# Altium schematic sheet Battery_Monitor.schdoc
size A4
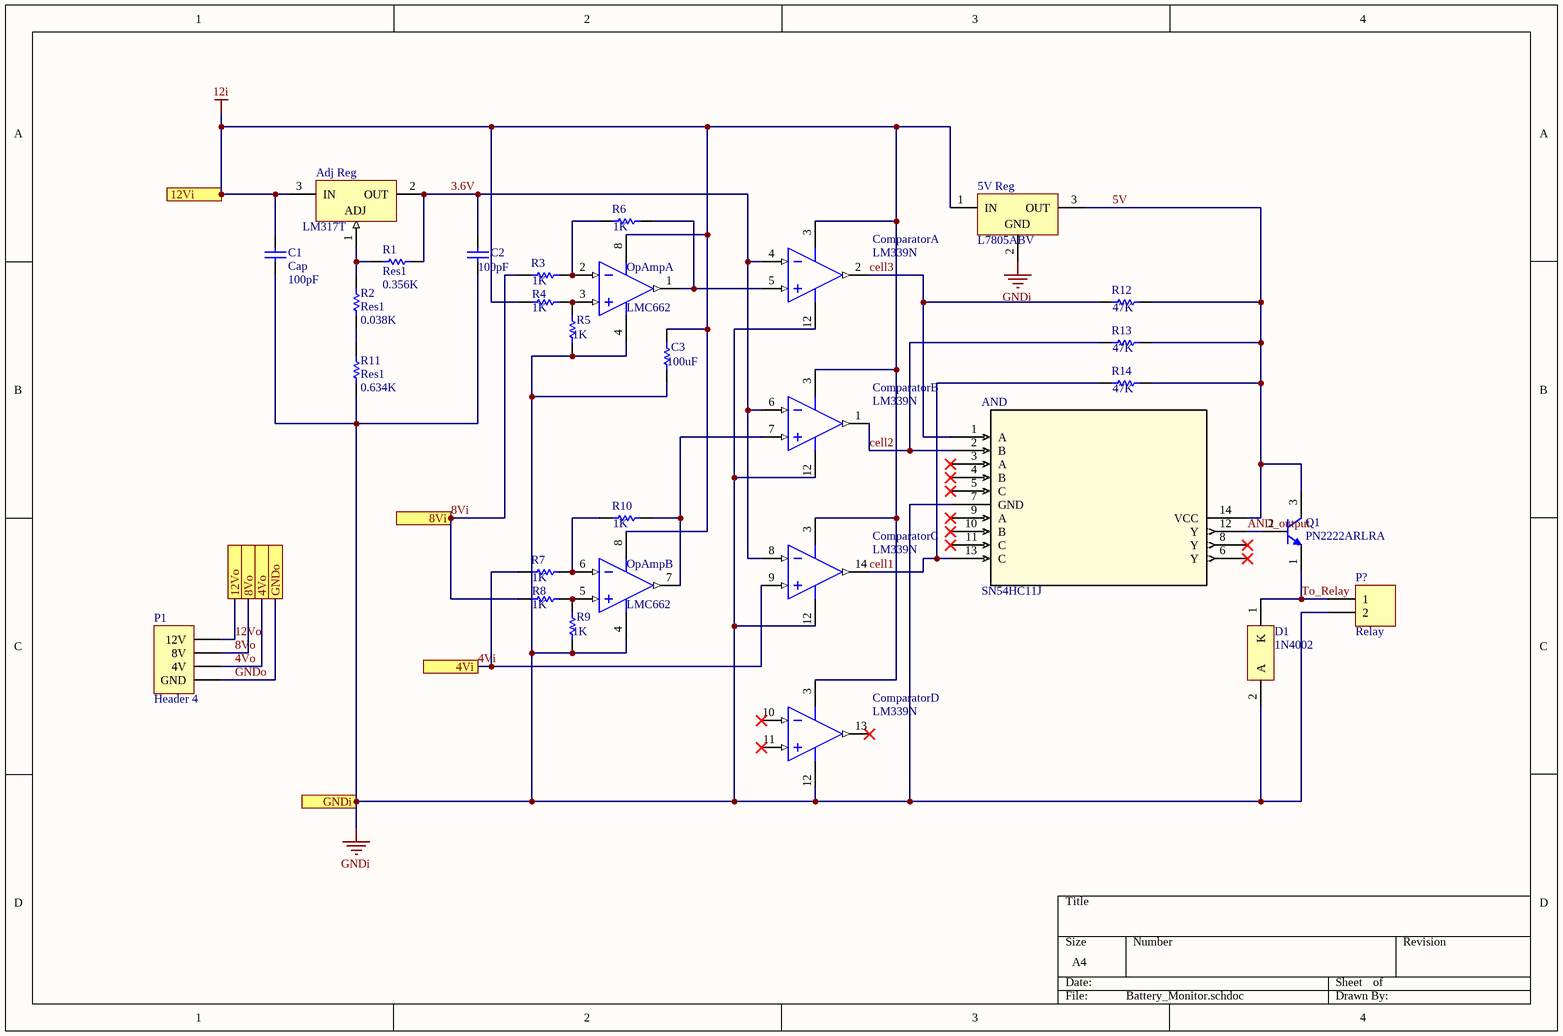
[diagram p0: Battery_Monitor.schdoc]

## Parts
5V_Reg  L7805ABV  [TO220]
Adj_Reg  LM317T  [TO-220]
AND  SN54HC11J  [J14]
C1  Cap  value 100pF  [RAD-0.3]
C2  value 100pF  [RAD-0.3]  (hidden comment: Cap)
C3  value 100uF  [AXIAL-0.3]  (hidden comment: Res1)
Comparator  LM339N  [N14A]  (parts A,B,C,D of 4)
D1  1N4002  [ONSC-AXIAL_LEAD-2-59-10_P]
OpAmp  LMC662  [N08E]  (parts A,B of 2)
P1  Header 4  [HDR1X4]
P?  Relay  [HDR1X2]
Q1  PN2222ARLRA  [ONSC-TO-92-3-29-11_AM_BL]
R1  Res1  value 0.356K  [AXIAL-0.3]
R2  Res1  value 0.038K  [AXIAL-0.3]
R3  value 1K  [AXIAL-0.3]  (hidden comment: Res1)
R4  value 1K  [AXIAL-0.3]  (hidden comment: Res1)
R5  value 1K  [AXIAL-0.3]  (hidden comment: Res1)
R6  value 1K  [AXIAL-0.3]  (hidden comment: Res1)
R7  value 1K  [AXIAL-0.3]  (hidden comment: Res1)
R8  value 1K  [AXIAL-0.3]  (hidden comment: Res1)
R9  value 1K  [AXIAL-0.3]  (hidden comment: Res1)
R10  value 1K  [AXIAL-0.3]  (hidden comment: Res1)
R11  Res1  value 0.634K  [AXIAL-0.3]
R12  value 47K  [AXIAL-0.3]  (hidden comment: Res1)
R13  value 47K  [AXIAL-0.3]  (hidden comment: Res1)
R14  value 47K  [AXIAL-0.3]  (hidden comment: Res1)

## Ports
4Vi, 4Vo, 8Vi, 8Vo, 12Vi, 12Vo, GNDi, GNDo

## Nets
12i: 5V_Reg.1(IN) Adj_Reg.3(IN) C1.2 C3.2 Comparator.3(V+) OpAmp.8(V+) R4.1 ; port 12Vi
GNDi: 5V_Reg.2(GND) AND.7(GND) C1.1 C2.2 C3.1 Comparator.12(GND) D1.2(A) OpAmp.4(V-) P?.2 R5.1 R9.1 R11.1 ; port GNDi
3.6V: Adj_Reg.2(OUT) C2.1 Comparator.4(IN1-) Comparator.6(IN2-) Comparator.8(IN3-) R1.2
4Vi: Comparator.9(IN3+) R7.1 ; port 4Vi
4Vo: P1.2(4V) ; port 4Vo
5V: 5V_Reg.3(OUT) AND.14(VCC) Q1.3(C) R12.2 R13.2 R14.2
8Vi: R3.1 R8.1 ; port 8Vi
8Vo: P1.3(8V) ; port 8Vo
12Vo: P1.4(12V) ; port 12Vo
AND_output: AND.12(Y) Q1.2(B)
cell1: AND.13(C) Comparator.14(OUT3) R14.1
cell2: AND.2(B) Comparator.1(OUT2) R13.1
cell3: AND.1(A) Comparator.2(OUT1) R12.1
GNDo: P1.1(GND) ; port GNDo
To_Relay: D1.1(K) P?.1 Q1.1(E)
NetAdj_Reg_1: Adj_Reg.1(ADJ) R1.1 R2.2
NetComparator_5: Comparator.5(IN1+) OpAmp.1(OUTA) R6.2
NetComparator_7: Comparator.7(IN2+) OpAmp.7(OUTB) R10.2
NetOpAmp_2: OpAmp.2(INA-) R3.2 R6.1
NetOpAmp_3: OpAmp.3(INA+) R4.2 R5.2
NetOpAmp_5: OpAmp.5(INB+) R8.2 R9.2
NetOpAmp_6: OpAmp.6(INB-) R7.2 R10.1
NetR2_1: R2.1 R11.2

Not connected (* = marked no-connect by the designer): AND 3(A)* 4(B)* 5(C)* 6(Y)* 8(Y)* 9(A)* 10(B)* 11(C)*; Comparator 10(IN4-)* 11(IN4+)* 13(OUT4)*

## Library data of the parts
5V_Reg = L7805ABV: Positive Voltage Regulator, 5V, 3-Pin TO-220; DatasheetVersion: Nov-2011; PackageVersion: ver3.0; PackageReference: TO220; PackageDescription: TO, Thru-Hole, Vertical, Heatsink Mounted; 3 In-Line Leads; Pitch 2.54 mm; PartNumber: L7805ABV; ComponentLink1Description: Manufacturer URL; ComponentLink1URL: http://www.st.com; ComponentLink2Description: Datasheet; ComponentLink2URL: http://www.st.com/internet/com/TECHNICAL_RESOURCES/TECHNICAL_LITERATURE/DATASHEET/CD00000444.pdf; ComponentLink3Description: Package Specification; ComponentLink3URL: http://www.st.com/internet/com/TECHNICAL_RESOURCES/TECHNICAL_LITERATURE/PACKAGE_INFORMATION/CD00004649.pdf
Adj_Reg = LM317T: 1.5A, 1.2V to 37V Adjustable Voltage Regulator, 3-Pin TO-220; DatasheetVersion: Nov-2011; PackageVersion: 2011; PackageReference: TO-220; PackageDescription: TO, Thru-Hole, Vertical, Heatsink Mounted; 3 In-Line Leads; Pitch 2.54 mm; PartNumber: LM317T; ComponentLink1Description: Manufacturer URL; ComponentLink1URL: http://www.st.com; ComponentLink2Description: Datasheet; ComponentLink2URL: http://www.st.com/internet/com/TECHNICAL_RESOURCES/TECHNICAL_LITERATURE/DATASHEET/CD00000455.pdf; ComponentLink3Description: Package Specification; ComponentLink3URL: http://www.st.com/internet/com/TECHNICAL_RESOURCES/TECHNICAL_LITERATURE/PACKAGE_INFORMATION/CD00004649.pdf
AND = SN54HC11J: No Description Available; Vendor: Texas Instruments; Built_By: EMA_UL_Team; Manufacturer_Part_Number: SN54HC11J; Copyright: Copyright (C) 2018 Accelerated Designs. All rights reserved; RefDes: RefDes; Type: DEV; Value: Value
C1 C2 = Cap: Capacitor; Published: 8-Jun-2000; LatestRevisionDate: 17-Jul-2002; LatestRevisionNote: Re-released for DXP Platform.; PackageReference: RAD-0.3; Publisher: Altium Limited; PackageDescription: Radial Cap, Thru-Hole; 2 Leads; 0.3 in Pin Spacing
C3 R1-R14 = Res1: Resistor; Published: 8-Jun-2000; LatestRevisionDate: 17-Jul-2002; LatestRevisionNote: Re-released for DXP Platform.; PackageReference: AXIAL-0.3; Publisher: Altium Limited; PackageDescription: Axial Device, Thru-Hole; 2 Leads; 0.3 in Pin Spacing
Comparator = LM339N: Low Power Low Offset Voltage Quad Comparator, 14-pin MDIP; Manufacturer: National Semiconductor; PackageTopMarking: NSUZXYYTTE#*LM339N; PowerWise: N; CompType: Amplifiers; High-Reliability: Y; DatasheetVersion: Mar-2004; PackageVersion: revG, May-2006; PackageReference: N14A; PackageDescription: MDIP, .750 x .250 x.130in, 14 Lead, .100in Pitch; PartNumber: LM339N; RoHS: N; PinCount: 14; Code_JEDEC: MS-001-AA; ComponentLink1Description: Manufacturer URL; ComponentLink1URL: http://www.national.com/; ComponentLink2Description: LM339 Datasheet; ComponentLink2URL: http://www.national.com/ds/LM/LM339.pdf; ComponentLink3Description: LM339 Web Page; ComponentLink3URL: http://www.national.com/pf/LM/LM339.html; ComponentLink4Description: N14A Package Page; ComponentLink4URL: http://www.national.com/packaging/folders/n14a.html
D1 = 1N4002: Standard Recovery Rectifier, 2-Pin Axial_Lead, Pb-Free, Bulk Bag; Manufacturer: On Semiconductor; IFSM Max (A): 30; IO(rec) Max (A): 1; VRRM Max (V): 100; DatasheetVersion: Rev. 13; PackageVersion: Rev. U, 02/2005; PackageReference: AXIAL_LEAD-2-59-10; PackageDescription: 2-Pin, Axial Lead, Diameter 2.35 mm; Supplier 1: Digi-Key; Supplier Part Number 1: 1N4002OS-ND; Packing: Bulk Bag; RoHS: TRUE; Type: Standard Recovery; Mounting Technology: Through Hole; PartNumber: 1N4002; ComponentLink1Description: Manufacturer URL; ComponentLink1URL: http://www.onsemi.com/; ComponentLink2Description: Datasheet; ComponentLink2URL: http://www.onsemi.com/pub_link/Collateral/1N4001-D.PDF; ComponentLink3Description: Package Specification; ComponentLink3URL: http://www.onsemi.cn/pub_link/Collateral/59-10.PDF
OpAmp = LMC662AIN: CMOS Dual Operational Amplifier, 8-pin MDIP; Manufacturer: National Semiconductor; PackageTopMarking: NSUZXYTTE#*LMC*662AIN; PowerWise: N; CompType: Amplifiers; High-Reliability: Y; DatasheetVersion: Apr-2003; PackageVersion: revG, May-2006; PackageReference: N08E; PackageDescription: MDIP, .365 x .250 x .130in, 8 Lead, .100in Pitch; PartNumber: LMC662AIN; RoHS: N; PinCount: 8; Code_JEDEC: MS-001-BA; ComponentLink1Description: Manufacturer URL; ComponentLink1URL: http://www.national.com/; ComponentLink2Description: LMC662 Datasheet; ComponentLink2URL: http://www.national.com/ds/LM/LMC662.pdf; ComponentLink3Description: LMC662 Web Page; ComponentLink3URL: http://www.national.com/pf/LM/LMC662.html; ComponentLink4Description: N08E Package Page; ComponentLink4URL: http://www.national.com/packaging/folders/n08e.html
P1 = Header 4: Header, 4-Pin; LatestRevisionDate: 17-Jul-2002; LatestRevisionNote: Re-released for DXP Platform.; Publisher: Altium Limited
P? = Header 2: Header, 2-Pin; LatestRevisionDate: 17-Jul-2002; LatestRevisionNote: Re-released for DXP Platform.; Publisher: Altium Limited
Q1 = PN2222ARLRA: General Purpose Transistor, NPN Silicon, 3-Pin TO-92, Tape and Reel; Manufacturer: On Semiconductor; fT Min (MHz): 300; IC Continuous (A): 0.6; DatasheetVersion: Rev. 5; PackageVersion: Rev. AM; PackageReference: TO-92-3-29-11_AM_BL; PackageDescription: 3-Pin Transistor Outline, Body 4.825 x 3.685 mm, Pitch 1.27 mm; Supplier 1: Digi-Key; Supplier Part Number 1: PN2222ARLRAOSCT-ND; Packing: Tape and Reel; Polarity: NPN; RoHS: FALSE; Mounting Technology: Through Hole; PartNumber: PN2222ARLRA; ComponentLink1Description: Manufacturer URL; ComponentLink1URL: http://www.onsemi.com/; ComponentLink2Description: Datasheet; ComponentLink2URL: http://www.onsemi.com/pub_link/Collateral/PN2222-D.PDF; ComponentLink3Description: Package Specification; ComponentLink3URL: http://www.onsemi.com/pub_link/Collateral/MAC97-D.PDF